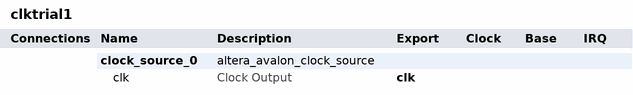
[diagram p0: system contents]
# Platform Designer (Qsys) system clktrial1, MAX 10 10M50DCF484C7G
# Parameters at their usual value, and those the tool derives, are not listed.
package require -exact qsys 20.1
create_system clktrial1
set_project_property DEVICE_FAMILY {MAX 10}
set_project_property DEVICE 10M50DCF484C7G

add_instance clock_source_0 altera_avalon_clock_source 20.1
set_instance_property clock_source_0 AUTO_EXPORT true
set_instance_parameter_value clock_source_0 CLOCK_RATE 10
set_instance_parameter_value clock_source_0 CLOCK_UNIT 1000000

# exported interfaces
add_interface clk clock source
set_interface_property clk EXPORT_OF clock_source_0.clk

set_interconnect_requirement {$system} qsys_mm.clockCrossingAdapter HANDSHAKE
set_interconnect_requirement {$system} qsys_mm.enableEccProtection FALSE
set_interconnect_requirement {$system} qsys_mm.insertDefaultSlave FALSE
set_interconnect_requirement {$system} qsys_mm.maxAdditionalLatency 1

save_system clktrial1.qsys
